# Altium project PIFWRobot.PrjPcb (part 2 of 2)

## Sheet decawave.SchDoc
size A4; DrawnBy: Van Tuan Ngo; Organization: PIF Club; Address1: 304B1, HCMUT,; Address2: Ly Thuong Kiet St.,; Address3: District 10, HCM, VN; DocumentNumber: 8; Revision: 1.0.0; SheetNumber: 8; SheetTotal: 8; Project: PIFWRobot
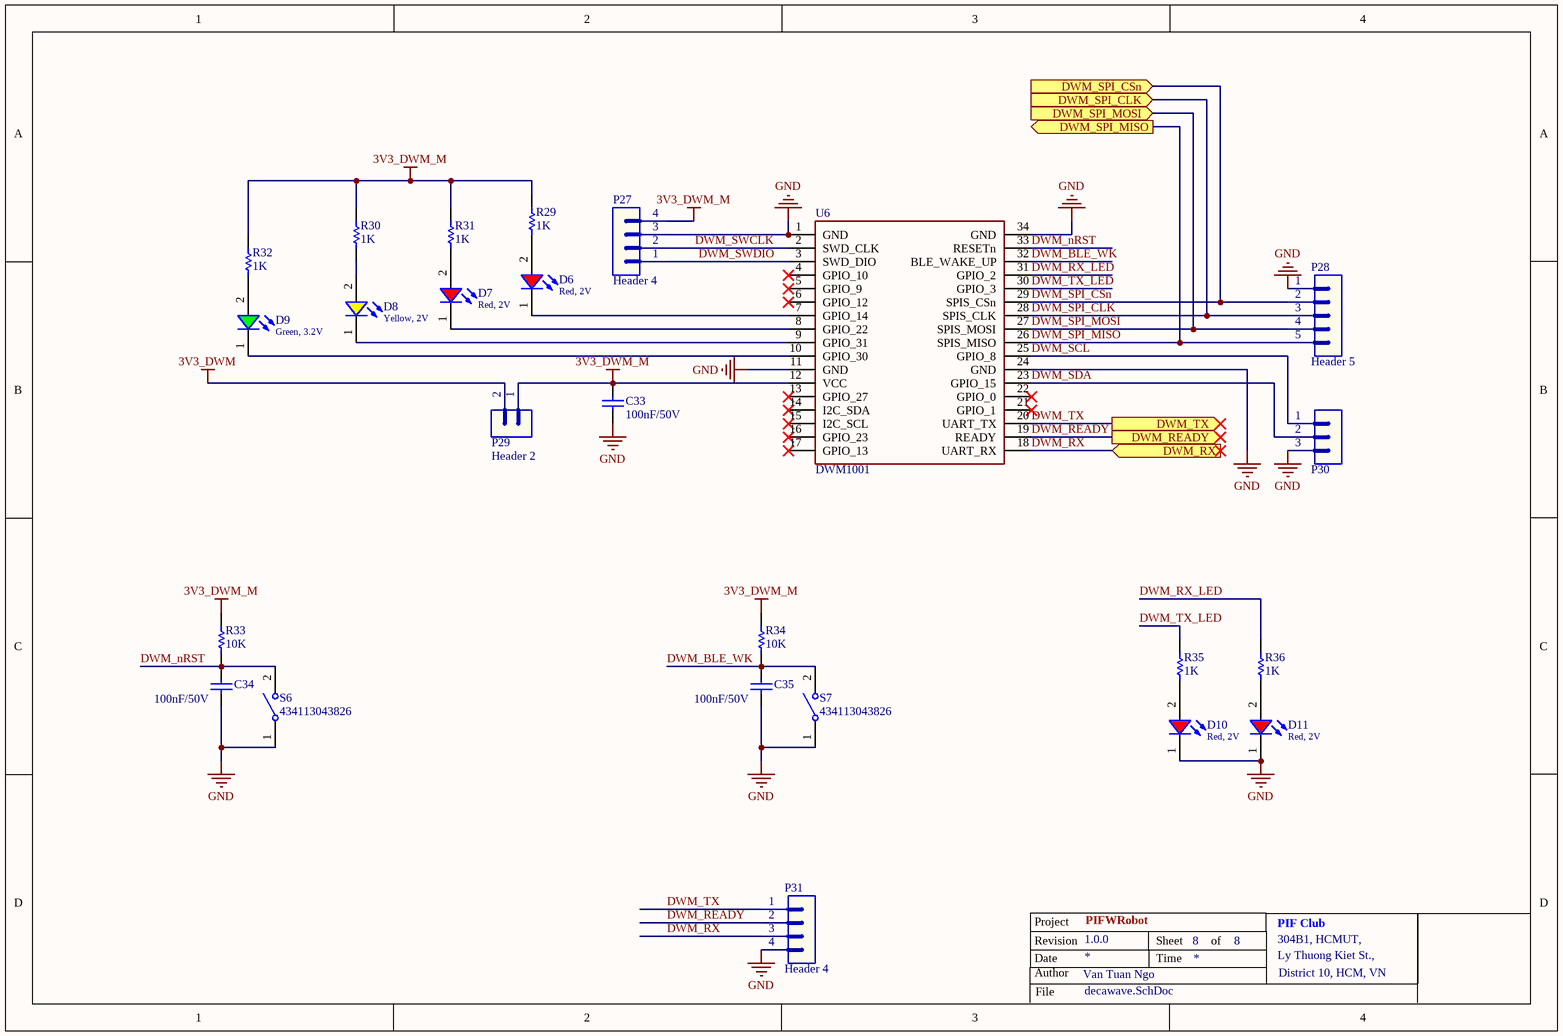
[diagram p7: decawave.SchDoc]

### Parts
C33  value 100nF/50V  [CAP-SM-0805]  (hidden comment: Cap-100nF-50V-0805)
C34  value 100nF/50V  [CAP-SM-0805]  (hidden comment: Cap-100nF-50V-0805)
C35  value 100nF/50V  [CAP-SM-0805]  (hidden comment: Cap-100nF-50V-0805)
D6  Red, 2V  [WL-SMCW_0805]
D7  Red, 2V  [WL-SMCW_0805]
D8  Yellow, 2V  [WL-SMCW_0805]
D9  Green, 3.2V  [WL-SMCW_0805]
D10  Red, 2V  [WL-SMCW_0805]
D11  Red, 2V  [WL-SMCW_0805]
P27  Header 4  [JP4]
P28  Header 5  [JP5]
P29  Header 2  [JP2]
P30  Header 3  [JP3]  (value not drawn)
P31  Header 4  [JP4]
R29  value 1K  [RES-SM-0805]  (hidden comment: Res-1K-0805)
R30  value 1K  [RES-SM-0805]  (hidden comment: Res-1K-0805)
R31  value 1K  [RES-SM-0805]  (hidden comment: Res-1K-0805)
R32  value 1K  [RES-SM-0805]  (hidden comment: Res-1K-0805)
R33  value 10K  [RES-SM-0805]  (hidden comment: Res-10k-0805)
R34  value 10K  [RES-SM-0805]  (hidden comment: Res-10k-0805)
R35  value 1K  [RES-SM-0805]  (hidden comment: Res-1K-0805)
R36  value 1K  [RES-SM-0805]  (hidden comment: Res-1K-0805)
S6  434113043826  [434113043826]
S7  434113043826  [434113043826]
U6  DWM1001  [DWM1001]

### Ports
DWM_READY (out), DWM_RX (in), DWM_SPI_CLK (in), DWM_SPI_CSn (in), DWM_SPI_MISO (out), DWM_SPI_MOSI (in), DWM_TX (out)

### Nets
3V3_DWM: P29.2
3V3_DWM_M: C33.2 P27.4 P29.1 R29.2 R30.2 R31.2 R32.2 R33.2 R34.2 U6.12(VCC)
GND: C33.1 C34.1 C35.1 D10.1(K) D11.1(K) P27.3 P28.1 P30.3 P31.4 S6.1 S7.1 U6.1(GND) U6.11(GND) U6.24(GND) U6.34(GND)
DWM_BLE_WK: C35.2 R34.1 S7.2 U6.32(BLE_WAKE_UP)
DWM_nRST: C34.2 R33.1 S6.2 U6.33(RESETn)
DWM_READY: P31.2 U6.19(READY) ; port DWM_READY
DWM_RX: P31.3 U6.18(UART_RX) ; port DWM_RX
DWM_RX_LED: R36.2 U6.31(GPIO_2)
DWM_SCL: P30.1 U6.25(GPIO_8)
DWM_SDA: P30.2 U6.23(GPIO_15)
DWM_SPI_CLK: P28.3 U6.28(SPIS_CLK) ; port DWM_SPI_CLK
DWM_SPI_CSn: P28.2 U6.29(SPIS_CSn) ; port DWM_SPI_CSn
DWM_SPI_MISO: P28.5 U6.26(SPIS_MISO) ; port DWM_SPI_MISO
DWM_SPI_MOSI: P28.4 U6.27(SPIS_MOSI) ; port DWM_SPI_MOSI
DWM_SWCLK: P27.2 U6.2(SWD_CLK)
DWM_SWDIO: P27.1 U6.3(SWD_DIO)
DWM_TX: P31.1 U6.20(UART_TX) ; port DWM_TX
DWM_TX_LED: R35.2 U6.30(GPIO_3)
NetD6_1: D6.1(K) U6.7(GPIO_14)
NetD6_2: D6.2(A) R29.1
NetD7_1: D7.1(K) U6.8(GPIO_22)
NetD7_2: D7.2(A) R31.1
NetD8_1: D8.1(K) U6.9(GPIO_31)
NetD8_2: D8.2(A) R30.1
NetD9_1: D9.1(K) U6.10(GPIO_30)
NetD9_2: D9.2(A) R32.1
NetD10_2: D10.2(A) R35.1
NetD11_2: D11.2(A) R36.1

Not connected (* = marked no-connect by the designer): U6 4(GPIO_10)* 5(GPIO_9)* 6(GPIO_12)* 13(GPIO_27)* 14(I2C_SDA)* 15(I2C_SCL)* 16(GPIO_23)* 17(GPIO_13)* 21(GPIO_1)* 22(GPIO_0)*

### Notes on the sheet
- Project
- Revision
- Date
- Author
- Sheet
- Time
- of
- File

### Library data of the parts
C33-C35 = Cap-100nF-50V-0805: CAP CER 0.1UF 50V Y5V 0805; Manufacturer: Samsung Electro-Mechanics; Manufacturer Part Number: CL21F104ZBCNNNC; Local Supplier: thegioiic; Local Supplier Link: https://thegioiic.com/products/tu-100nf-0-1uf-50v-0805; Supplier 1: Digikey; Supplier 1 Part Number: 1276-1007-1-ND; Supplier 1 Link: https://www.digikey.com/product-detail/en/samsung-electro-mechanics/CL21F104ZBCNNNC/1276-1007-1-ND/3889093
D6 D7 D10 D11 = 0805-Red: WL-SMCW SMT Mono-color Chip LED Waterclear, size 0805, Red, 2V, 140deg; Part Number: 150080RS75000; Chip Technology: AlInGaP; Dominant Wavelength typ.: 625nm; Luminous Intensity typ.: 150mcd; Peak Wavelength typ.: 630nm; Viewing Angle: 140deg; ComponentLink1Description: Manufacturer; ComponentLink1URL: http://www.we-online.de; ComponentLink2URL: https://www.we-online.com/catalog/datasheet/150080RS75000.pdf; ComponentLink2Description: Datasheet; Forward Voltage typ.: 2V; Emitting Color: Red; Mounting Technology: SMT; Operating Temperature: -40 to +85degC; Published Date: December 2019; Packaging: Tape and Reel; Size: 0805; Publisher: Wurth Elektronik; Local Supplier: thegioiic; Local Supplier Partnumber: x; Local Supplier Link: https://www.thegioiic.com/products/led-do-0805-dan-smd-trong-suot-harvatek
D8 = 0805-Yellow: WL-SMCW SMT Mono-color Chip LED Waterclear, size 0805, Yellow, 2V, 140deg; Part Number: 150080YS75000; Chip Technology: AlInGaP; Dominant Wavelength typ.: 590nm; Luminous Intensity typ.: 120mcd; Peak Wavelength typ.: 595nm; Viewing Angle: 140deg; ComponentLink1Description: Manufacturer; ComponentLink1URL: http://www.we-online.de; ComponentLink2URL: https://www.we-online.com/catalog/datasheet/150080YS75000.pdf; ComponentLink2Description: Datasheet; Forward Voltage typ.: 2V; Emitting Color: Yellow; Mounting Technology: SMT; Operating Temperature: -40 to +85degC; Published Date: December 2019; Packaging: Tape and Reel; Size: 0805; Publisher: Wurth Elektronik; Local Supplier: thegioiic; Local Supplier Part Number: x; Local Supplier Link: https://www.thegioiic.com/products/led-vang-0805-dan-smd-trong-suot-harvatek
D9 = 0805-Green: WL-SMCW SMT Mono-color Chip LED Waterclear, size 0805, Green, 3.2V, 140deg; Part Number: 150080GS75000; Chip Technology: InGaN; Dominant Wavelength typ.: 525nm; Luminous Intensity typ.: 450mcd; Peak Wavelength typ.: 515nm; Viewing Angle: 140deg; ComponentLink1Description: Manufacturer; ComponentLink1URL: http://www.we-online.de; ComponentLink2URL: https://www.we-online.com/catalog/datasheet/150080GS75000.pdf; ComponentLink2Description: Datasheet; Forward Voltage typ.: 3.2V; Emitting Color: Green; Mounting Technology: SMT; Operating Temperature: -40 to +85degC; Published Date: December 2019; Packaging: Tape and Reel; Size: 0805; Publisher: Wurth Elektronik; Local Supplier: thegioiic; Local Supplier Part Number: x; Local Supplier Link: https://www.thegioiic.com/products/led-xanh-la-0805-dan-smd-trong-suot-harvatek
P27 P31 = Header 4: Header, 4-Pin; LatestRevisionDate: 17-Jul-2002; LatestRevisionNote: Re-released for DXP Platform.; Publisher: Altium Limited; Local Supplier: thegioiic; Local Supplier Part Number: x; Local Supplier Link: https://www.thegioiic.com/products/hang-rao-duc-don-2-54mm-40-chan-1-hang-cao-11-4mm-xuyen-lo
P28 = Header 5: Header, 5-Pin; LatestRevisionDate: 17-Jul-2002; LatestRevisionNote: Re-released for DXP Platform.; Publisher: Altium Limited; Local Supplier Link: https://www.thegioiic.com/products/hang-rao-duc-don-2-54mm-40-chan-1-hang-cao-11-4mm-xuyen-lo; Local Supplier: thegioiic; Local Supplier Part Number: x
P29 = Header 2: Header, 2-Pin; LatestRevisionDate: 17-Jul-2002; LatestRevisionNote: Re-released for DXP Platform.; Publisher: Altium Limited; Local Supplier: thegioiic; Local Supplier Part Number: x; Local Supplier Link: https://www.thegioiic.com/products/hang-rao-duc-don-2-54mm-40-chan-1-hang-cao-11-4mm-xuyen-lo
P30 = Header 3: Header, 3-Pin; LatestRevisionDate: 17-Jul-2002; LatestRevisionNote: Re-released for DXP Platform.; Publisher: Altium Limited; Local Supplier: thegioiic; Local Supplier Part Number: x; Local Supplier Link: https://www.thegioiic.com/products/hang-rao-duc-don-2-54mm-40-chan-1-hang-cao-11-4mm-xuyen-lo
R29-R32 R35 R36 = Res-1K-0805: RES 1K OHM 1% 1/4W 0805; Manufacturer: Stackpole Electronics Inc; Manufacturer Part Number: RNCP0805FTD1K00; Local Supplier: thegioiic; Local Supplier Link: https://www.thegioiic.com/products/dien-tro-1-kohm-0805-5; Supplier 1: Digikey; Supplier 1 Link: https://www.digikey.com/product-detail/en/stackpole-electronics-inc/RNCP0805FTD1K00/RNCP0805FTD1K00CT-ND/2240568; Supplier 1 Part Number: RNCP0805FTD1K00CT-ND
R33 R34 = Res-10k-0805: RES 10K OHM 1% 1/4W 0805; Manufacturer: Stackpole Electronics Inc; Manufacturer Part Number: RNCP0805FTD10K0; Local Supplier: thegioiic; Local Supplier Link: https://www.thegioiic.com/products/dien-tro-10-kohm-0805-5; Supplier 1: Digikey; Supplier 1 Link: https://www.digikey.com/product-detail/en/stackpole-electronics-inc/RNCP0805FTD10K0/RNCP0805FTD10K0CT-ND/2240601; Supplier 1 Part Number: RNCP0805FTD10K0CT-ND
S6 S7 = 434113043826: WS-TASV J-Bend SMT Tact Switch 6x3.5mm, height 4.3mm, 260gf; Rated Voltage: 12VDC; Rated Current: 50mA; Washable: No; ComponentLink1Description: Manufacturer; ComponentLink1URL: http://www.we-online.de; ComponentLink2Description: Datasheet; ComponentLink2URL: https://katalog.we-online.com/em/datasheet/434113043826.pdf; Operating Temperature: -40 to +85degC; Part Number: 434113043826; Published Date: September 2019; Contact Material: Stainless Steel; Height: 4.3mm; Mounting Technology: SMT; Contact Plating: Silver; Operation Force: 260gf; Packaging: Tape and Reel; Terminal Material: Copper Alloy; Publisher: Wurth Elektronik; Terminal Plating: Silver; Local Supplier: thegioiic; Local Supplier Link: https://www.thegioiic.com/products/nut-nhan-3-5x6mm-cao-5mm-2-chan-smd-dau-trang; Local Supplier Part Number: x
U6 = DWM1001: Local Supplier: x; Local Supplier Part Number: x; Local Supplier Link: x

## Nets that join several sheets
3V3_BLU: power_supply (C18.2 IC4.2 IC4.4), bluetooth (M5.12 S5.2)
3V3_DWM: power_supply (C15.2 IC3.2 IC3.4), decawave (P29.2)
3V3_MC: power_supply (C13.2 C14.2 IC2.2 IC2.4), motor_controller (11 pins), mcu (12 pins), sensor (6 pins)
3V3_RF: power_supply (C17.2 U3.5), radio_frequency (C23.2 M6.2 P25.2 P26.2)
3V3_WIFI: power_supply (C12.2 IC1.2 IC1.4), wifi (11 pins)
5V: power_supply (10 pins), motor_controller (P6.3), mcu (B1.1 J1.1), bluetooth (C21.2 M4.5), radio_frequency (C25.2 M9.1)
5V_WIFI: power_supply (IC1.3 P19.2), wifi (C31.2 C32.2 D5.1 U5.8)
12V: power_supply (C9.1 C10.2 P18.1 PI1.1), motor_controller (P4.1 P5.1)
GND: power_supply (19 pins), motor_controller (19 pins), mcu (16 pins), sensor (6 pins), bluetooth (10 pins), wifi (14 pins), radio_frequency (11 pins), decawave (15 pins)
BLU_KEY: mcu (U1.32), bluetooth (C22.2 P22.2 R17.1 S5.1)
BLUE_RX: mcu (U1.30), bluetooth (M4.2 M5.2 P23.2)
BLUE_TX: mcu (U1.31), bluetooth (M4.3 M5.1 P23.1)
DWM_SPI_CLK: mcu (U1.26), decawave (P28.3 U6.28)
DWM_SPI_CSn: mcu (U1.25), decawave (P28.2 U6.29)
DWM_SPI_MISO: mcu (U1.27), decawave (P28.5 U6.26)
DWM_SPI_MOSI: mcu (U1.28), decawave (P28.4 U6.27)
ESP_TX: mcu (U1.13), wifi (M10.22 U5.25)
NetM3_3: mcu (U1.45), sensor (M3.3)
NetM3_4: mcu (U1.46), sensor (M3.4)
NetM5_11: mcu (U1.14), bluetooth (M5.11)
NetM6_3: mcu (U1.33), radio_frequency (M6.3)
NetM6_4: mcu (U1.38), radio_frequency (M6.4)
NetM6_5: mcu (U1.39), radio_frequency (M6.5)
NetM6_6: mcu (U1.41), radio_frequency (M6.6)
NetM6_7: mcu (U1.40), radio_frequency (M6.7)
NetR14_1: power_supply (R14.1), mcu (U1.15)
NetR19_1: mcu (U1.12), wifi (R19.1)
NetU1_3: motor_controller (U2.3), mcu (U1.3)
NetU1_4: motor_controller (U2.6), mcu (U1.4)
NetU1_5: motor_controller (U2.5), mcu (U1.5)
NetU1_6: motor_controller (U2.7), mcu (U1.6)
NetU1_10: motor_controller (U2.2), mcu (U1.10)
NetU1_11: motor_controller (U2.4), mcu (U1.11)
NetU1_16: mcu (U1.16), sensor (U4.2)
NetU1_17: mcu (U1.17), sensor (U4.4)
NetU1_42: mcu (U1.42), sensor (U4.8)
NetU1_43: mcu (U1.43), sensor (U4.6)
RF_RXD: mcu (U1.21), radio_frequency (M7.2 M8.3 M9.2 P24.5)
RF_SET: mcu (U1.19), radio_frequency (M7.4 M8.5 P24.3 R38.1)
RF_TXD: mcu (U1.22), radio_frequency (M7.3 M8.4 M9.3 P24.4)